# Altium schematic sheet MINI MSK12CO2_2022-02-25.schdoc
size 46 x 37 mm
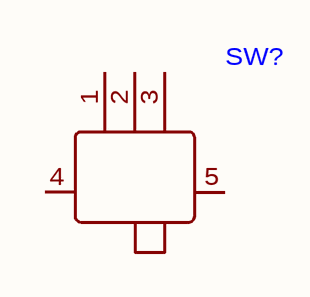
[diagram p0: MINI MSK12CO2_2022-02-25.schdoc]

## Parts
SW?  (no value)  [SW-SMD_MSK12CO2]

## Nets

Not connected (* = marked no-connect by the designer): SW? 1 2 3 4 5

## Library data of the parts
SW? = MINI MSK12CO2